# Altium schematic sheet Rotary LCD.SchDoc: Rotary LCD
size B; Date: 12/5/2023; Revision: 00; SheetNumber: 5; SheetTotal: 5
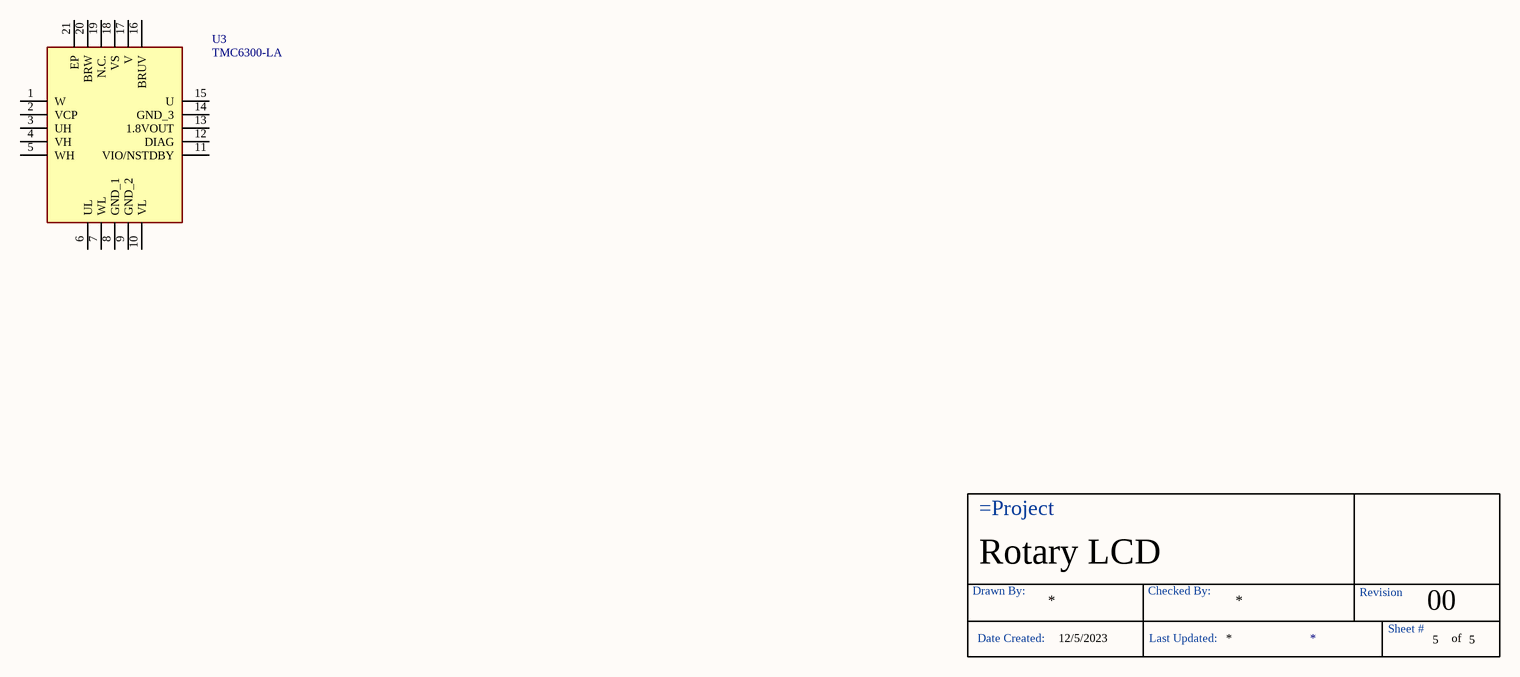
[diagram p0: Rotary LCD.SchDoc]

## Parts
?  Title Block  (value not drawn)
U3  TMC6300-LA  [QFN40P300X300X90-21N]

## Nets

Not connected (* = marked no-connect by the designer): U3 1(W) 2(VCP) 3(UH) 4(VH) 5(WH) 6(UL) 7(WL) 8(GND_1) 9(GND_2) 10(VL) 11(VIO/NSTDBY) 12(DIAG) 13(1.8VOUT) 14(GND_3) 15(U) 16(BRUV) 17(V) 18(VS) 19(N.C.) 20(BRW) 21(EP)

## Notes on the sheet
- (in symbol Title Block) Drawn By:; Checked By:; Revision; Sheet #; Date Created:; Last Updated:; of

## Library data of the parts
U3 = TMC6300-LA: Integrated Circuit; Manufacturer_Name: Analog Devices; Datasheet Link: https://www.analog.com/TMC6300/datasheet; Height: 0.9mm; Manufacturer_Part_Number: TMC6300-LA; Mouser Part Number: 700-TMC6300-LA; Mouser Price/Stock: https://www.mouser.co.uk/ProductDetail/ADI-Trinamic/TMC6300-LA?qs=QNEnbhJQKvYIagO3WUG%252BYg%3D%3D; Arrow Part Number: TMC6300-LA; Arrow Price/Stock: https://www.arrow.com/en/products/tmc6300-la/analog-devices?region=nac